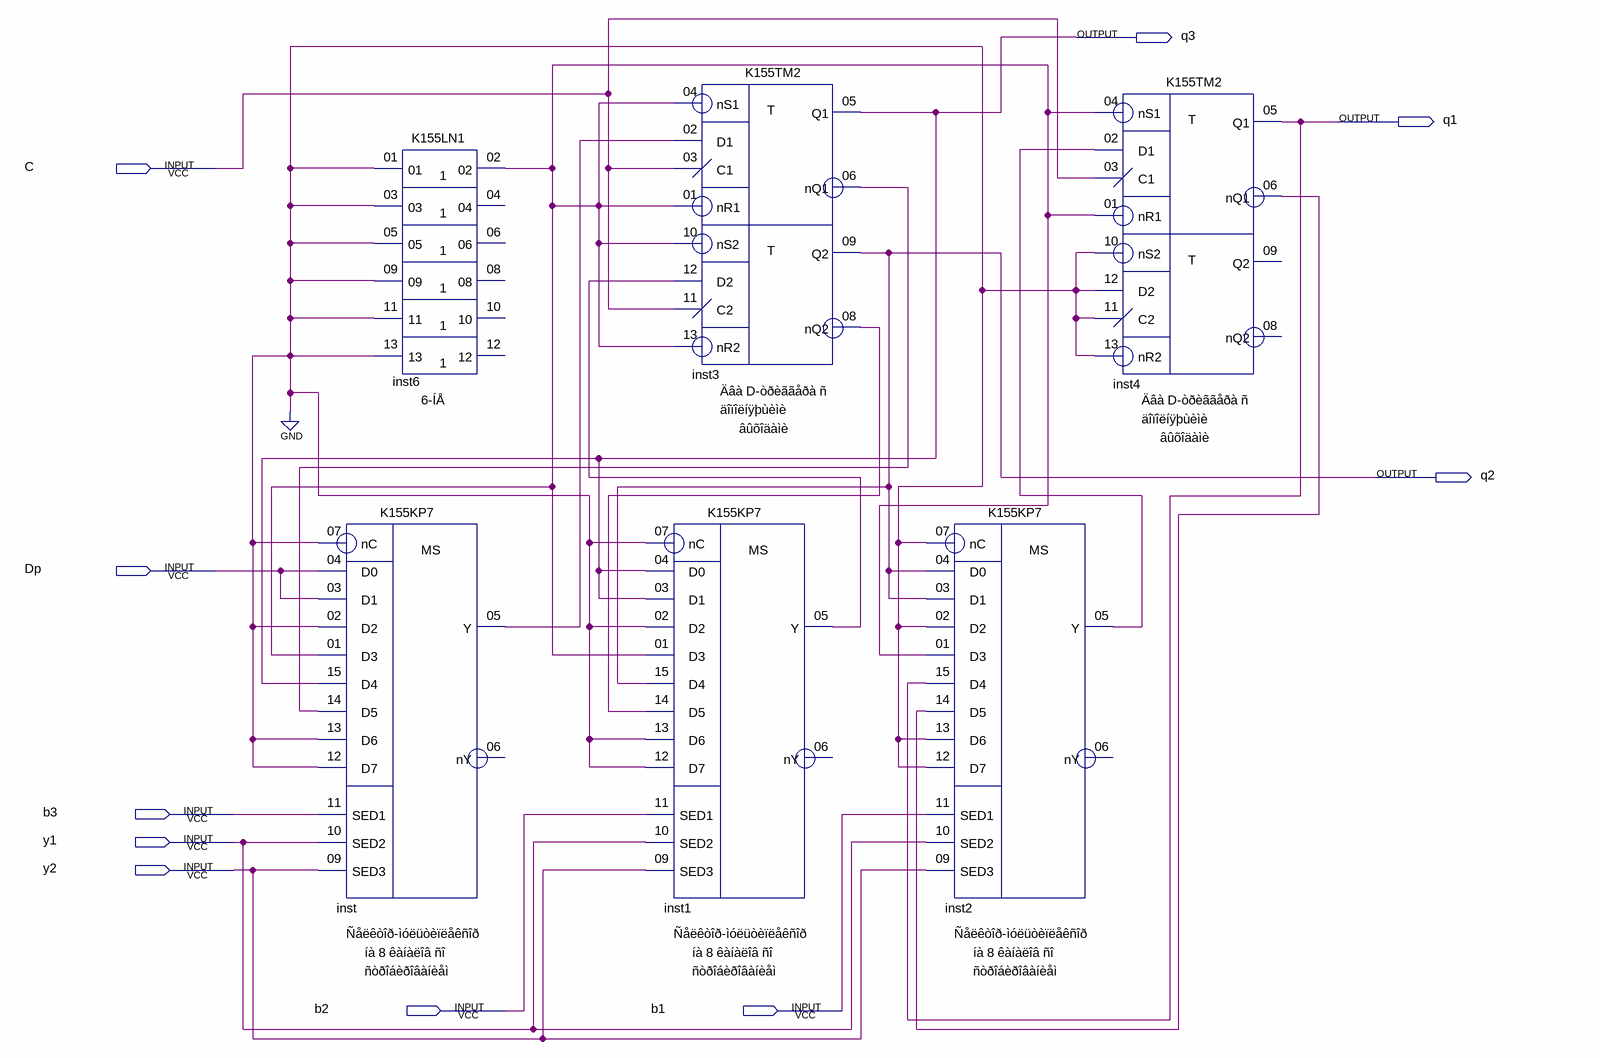
[diagram p0: schematic sheet]
// Quartus schematic lab4.bdf as structural Verilog: 6 symbols, 10 pins
module lab4 (
  input  C,
  input  Dp,
  input  b3,
  input  y1,
  input  y2,
  input  b2,
  input  b1,
  output q3,
  output q1,
  output q2
);

  wire inst1_y, inst2_y, inst3_nq1, inst3_nq2, inst4_nq1, inst6_02, inst_y;

  K155KP7 inst (
    .nC(1'b0), .D0(Dp), .D1(Dp), .D2(1'b0), .D3(inst6_02), .D4(q3), .D5(inst3_nq1), .D6(1'b0), .D7(1'b0),
    .SED1(b3), .SED2(y1), .SED3(y2), .Y(inst_y));  // open: nY
  K155LN1 inst6 (
    .\01 (1'b0), .\03 (1'b0), .\05 (1'b0), .\09 (1'b0), .\11 (1'b0), .\13 (1'b0), .\02 (inst6_02));  // open: 04, 06, 08, 10, 12
  K155KP7 inst1 (
    .nC(1'b0), .D0(q3), .D1(q3), .D2(1'b0), .D3(inst6_02), .D4(q2), .D5(inst3_nq2), .D6(1'b0), .D7(1'b0),
    .SED1(b2), .SED2(y1), .SED3(y2), .Y(inst1_y));  // open: nY
  K155TM2 inst3 (
    .nS1(inst6_02), .nR1(inst6_02), .C1(C), .D1(inst_y), .nS2(inst6_02), .nR2(inst6_02), .C2(C),
    .D2(inst1_y), .Q1(q3), .nQ1(inst3_nq1), .Q2(q2), .nQ2(inst3_nq2));
  K155KP7 inst2 (
    .nC(1'b0), .D0(q2), .D1(q2), .D2(1'b0), .D3(inst6_02), .D4(q1), .D5(inst4_nq1), .D6(1'b0), .D7(1'b0),
    .SED1(b1), .SED2(y1), .SED3(y2), .Y(inst2_y));  // open: nY
  K155TM2 inst4 (
    .nS1(inst6_02), .nR1(inst6_02), .C1(C), .D1(inst2_y), .nS2(1'b0), .nR2(1'b0), .C2(1'b0), .D2(1'b0),
    .Q1(q1), .nQ1(inst4_nq1));  // open: Q2, nQ2
endmodule
